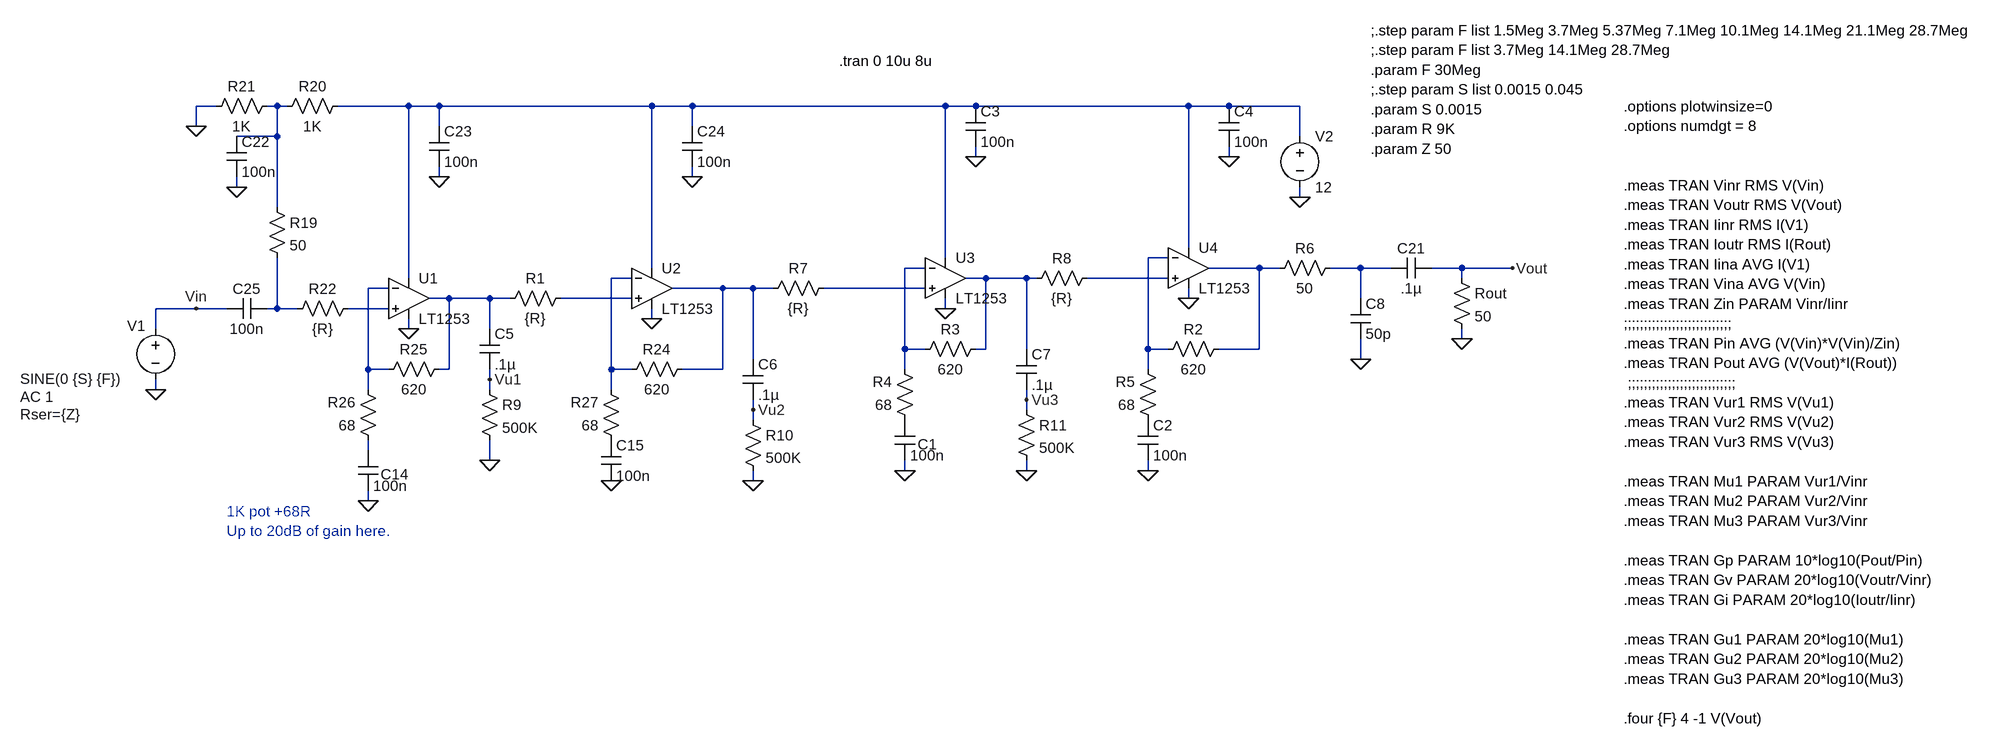
[diagram p0: schematic LT1253 Pre Amp Testing.asc]
LT1253 Pre Amp Testing.asc, the LTspice schematic file:
Version 4
SHEET 1 3748 1760
WIRE -3344 -288 -3376 -288
WIRE -3248 -288 -3264 -288
WIRE -3232 -288 -3248 -288
WIRE -3040 -288 -3152 -288
WIRE -2992 -288 -3040 -288
WIRE -2656 -288 -2992 -288
WIRE -2592 -288 -2656 -288
WIRE -2192 -288 -2592 -288
WIRE -2144 -288 -2192 -288
WIRE -1808 -288 -2144 -288
WIRE -1744 -288 -1808 -288
WIRE -1632 -288 -1744 -288
WIRE -3376 -256 -3376 -288
WIRE -2992 -256 -2992 -288
WIRE -2592 -256 -2592 -288
WIRE -3248 -240 -3248 -288
WIRE -3248 -240 -3312 -240
WIRE -1632 -240 -1632 -288
WIRE -2144 -208 -2144 -224
WIRE -1744 -208 -1744 -224
WIRE -2992 -176 -2992 -192
WIRE -2592 -176 -2592 -192
WIRE -3312 -160 -3312 -176
WIRE -1632 -144 -1632 -160
WIRE -3248 -128 -3248 -240
WIRE -1808 -64 -1808 -288
WIRE -2192 -48 -2192 -288
WIRE -1840 -48 -1872 -48
WIRE -2656 -32 -2656 -288
WIRE -2224 -32 -2256 -32
WIRE -1696 -32 -1776 -32
WIRE -1664 -32 -1696 -32
WIRE -1536 -32 -1584 -32
WIRE -1488 -32 -1536 -32
WIRE -1376 -32 -1424 -32
WIRE -1296 -32 -1376 -32
WIRE -3040 -16 -3040 -288
WIRE -2688 -16 -2720 -16
WIRE -2128 -16 -2160 -16
WIRE -2064 -16 -2128 -16
WIRE -2048 -16 -2064 -16
WIRE -1840 -16 -1968 -16
WIRE -1376 -16 -1376 -32
WIRE -3072 0 -3104 0
WIRE -2544 0 -2624 0
WIRE -2496 0 -2544 0
WIRE -2464 0 -2496 0
WIRE -2224 0 -2384 0
WIRE -2976 16 -3008 16
WIRE -2912 16 -2976 16
WIRE -2880 16 -2912 16
WIRE -2688 16 -2800 16
WIRE -1808 16 -1808 0
WIRE -1536 16 -1536 -32
WIRE -3376 32 -3440 32
WIRE -3328 32 -3376 32
WIRE -3248 32 -3248 -48
WIRE -3248 32 -3264 32
WIRE -3216 32 -3248 32
WIRE -3072 32 -3136 32
WIRE -2192 32 -2192 16
WIRE -2656 48 -2656 32
WIRE -3440 64 -3440 32
WIRE -3040 64 -3040 48
WIRE -2912 64 -2912 16
WIRE -1376 80 -1376 64
WIRE -2256 96 -2256 -32
WIRE -2224 96 -2256 96
WIRE -2128 96 -2128 -16
WIRE -2128 96 -2144 96
WIRE -2064 96 -2064 -16
WIRE -1872 96 -1872 -48
WIRE -1840 96 -1872 96
WIRE -1696 96 -1696 -32
WIRE -1696 96 -1760 96
WIRE -2496 112 -2496 0
WIRE -1536 112 -1536 80
WIRE -3104 128 -3104 0
WIRE -3072 128 -3104 128
WIRE -2976 128 -2976 16
WIRE -2976 128 -2992 128
WIRE -2720 128 -2720 -16
WIRE -2688 128 -2720 128
WIRE -2544 128 -2544 0
WIRE -2544 128 -2608 128
WIRE -2256 128 -2256 96
WIRE -1872 128 -1872 96
WIRE -2912 144 -2912 128
WIRE -3440 160 -3440 144
WIRE -3104 160 -3104 128
WIRE -2912 160 -2912 144
WIRE -2720 160 -2720 128
WIRE -2064 176 -2064 160
WIRE -2496 192 -2496 176
WIRE -2064 192 -2064 176
WIRE -2496 208 -2496 192
WIRE -3104 256 -3104 240
WIRE -2912 272 -2912 240
WIRE -2256 288 -2256 272
WIRE -2064 288 -2064 272
WIRE -1872 288 -1872 272
WIRE -2496 304 -2496 288
WIRE -3104 336 -3104 320
FLAG -3440 160 0
FLAG -3376 32 Vin
FLAG -2992 -176 0
FLAG -3312 -160 0
FLAG -3040 64 0
FLAG -2656 48 0
FLAG -2720 304 0
FLAG -2592 -176 0
FLAG -3376 -256 0
FLAG -3104 336 0
FLAG -2144 -208 0
FLAG -2192 32 0
FLAG -1808 16 0
FLAG -1872 288 0
FLAG -1744 -208 0
FLAG -2256 288 0
FLAG -1632 -144 0
FLAG -1376 80 0
FLAG -1296 -32 Vout
FLAG -2912 144 Vu1
FLAG -2912 272 0
FLAG -2496 192 Vu2
FLAG -2496 304 0
FLAG -2064 176 Vu3
FLAG -2064 288 0
FLAG -1536 112 0
SYMBOL voltage -3440 48 R0
WINDOW 0 -45 11 Left 2
WINDOW 3 -214 95 Left 2
WINDOW 123 -214 123 Left 2
WINDOW 39 -214 151 Left 2
SYMATTR InstName V1
SYMATTR Value SINE(0 {S} {F})
SYMATTR Value2 AC 1
SYMATTR SpiceLine Rser={Z}
SYMBOL voltage -1632 -256 R0
WINDOW 123 0 0 Left 0
WINDOW 39 0 0 Left 0
SYMATTR InstName V2
SYMATTR Value 12
SYMBOL Opamps\\LT1253 -3040 -48 R0
SYMATTR InstName U1
SYMBOL Opamps\\LT1253 -2656 -64 R0
SYMATTR InstName U2
SYMBOL res -3264 -144 R0
SYMATTR InstName R19
SYMATTR Value 50
SYMBOL res -3136 -304 R90
WINDOW 0 0 56 VBottom 2
WINDOW 3 32 56 VTop 2
SYMATTR InstName R20
SYMATTR Value 1K
SYMBOL res -3248 -304 R90
WINDOW 0 0 56 VBottom 2
WINDOW 3 32 56 VTop 2
SYMATTR InstName R21
SYMATTR Value 1K
SYMBOL res -3120 16 R90
WINDOW 0 0 56 VBottom 2
WINDOW 3 32 56 VTop 2
SYMATTR InstName R22
SYMATTR Value {R}
SYMBOL res -2592 112 R90
WINDOW 0 0 56 VBottom 2
WINDOW 3 32 56 VTop 2
SYMATTR InstName R24
SYMATTR Value 620
SYMBOL res -2976 112 R90
WINDOW 0 0 56 VBottom 2
WINDOW 3 32 56 VTop 2
SYMATTR InstName R25
SYMATTR Value 620
SYMBOL res -3088 256 R180
WINDOW 0 36 76 Left 2
WINDOW 3 36 40 Left 2
SYMATTR InstName R26
SYMATTR Value 68
SYMBOL res -2704 256 R180
WINDOW 0 36 76 Left 2
WINDOW 3 36 40 Left 2
SYMATTR InstName R27
SYMATTR Value 68
SYMBOL cap -3120 256 R0
WINDOW 0 36 38 Left 2
SYMATTR InstName C14
SYMATTR Value 100n
SYMBOL cap -2736 240 R0
SYMATTR InstName C15
SYMATTR Value 100n
SYMBOL cap -3328 -240 R0
SYMATTR InstName C22
SYMATTR Value 100n
SYMBOL cap -3008 -256 R0
SYMATTR InstName C23
SYMATTR Value 100n
SYMBOL cap -2608 -256 R0
SYMATTR InstName C24
SYMATTR Value 100n
SYMBOL cap -3264 16 R90
WINDOW 0 0 32 VBottom 2
WINDOW 3 32 32 VTop 2
SYMATTR InstName C25
SYMATTR Value 100n
SYMBOL Opamps\\LT1253 -2192 -80 R0
SYMATTR InstName U3
SYMBOL Opamps\\LT1253 -1808 -96 R0
SYMATTR InstName U4
SYMBOL res -1744 80 R90
WINDOW 0 0 56 VBottom 2
WINDOW 3 32 56 VTop 2
SYMATTR InstName R2
SYMATTR Value 620
SYMBOL res -2128 80 R90
WINDOW 0 0 56 VBottom 2
WINDOW 3 32 56 VTop 2
SYMATTR InstName R3
SYMATTR Value 620
SYMBOL res -2240 224 R180
WINDOW 0 36 76 Left 2
WINDOW 3 36 40 Left 2
SYMATTR InstName R4
SYMATTR Value 68
SYMBOL res -1856 224 R180
WINDOW 0 36 76 Left 2
WINDOW 3 36 40 Left 2
SYMATTR InstName R5
SYMATTR Value 68
SYMBOL cap -2272 208 R0
WINDOW 0 36 38 Left 2
SYMATTR InstName C1
SYMATTR Value 100n
SYMBOL cap -1888 208 R0
SYMATTR InstName C2
SYMATTR Value 100n
SYMBOL cap -2160 -288 R0
SYMATTR InstName C3
SYMATTR Value 100n
SYMBOL cap -1760 -288 R0
SYMATTR InstName C4
SYMATTR Value 100n
SYMBOL res -1568 -48 R90
WINDOW 0 0 56 VBottom 2
WINDOW 3 32 56 VTop 2
SYMATTR InstName R6
SYMATTR Value 50
SYMBOL res -2784 0 R90
WINDOW 0 0 56 VBottom 2
WINDOW 3 32 56 VTop 2
SYMATTR InstName R1
SYMATTR Value {R}
SYMBOL res -2368 -16 R90
WINDOW 0 0 56 VBottom 2
WINDOW 3 32 56 VTop 2
SYMATTR InstName R7
SYMATTR Value {R}
SYMBOL res -1952 -32 R90
WINDOW 0 0 56 VBottom 2
WINDOW 3 32 56 VTop 2
SYMATTR InstName R8
SYMATTR Value {R}
SYMBOL cap -1424 -48 R90
WINDOW 0 0 32 VBottom 2
WINDOW 3 32 32 VTop 2
SYMATTR InstName C21
SYMATTR Value .1µ
SYMBOL res -1392 -32 R0
SYMATTR InstName Rout
SYMATTR Value 50
SYMBOL cap -2928 64 R0
SYMATTR InstName C5
SYMATTR Value .1µ
SYMBOL res -2928 144 R0
SYMATTR InstName R9
SYMATTR Value 500K
SYMBOL cap -2512 112 R0
SYMATTR InstName C6
SYMATTR Value .1µ
SYMBOL res -2512 192 R0
SYMATTR InstName R10
SYMATTR Value 500K
SYMBOL cap -2080 96 R0
SYMATTR InstName C7
SYMATTR Value .1µ
SYMBOL res -2080 176 R0
SYMATTR InstName R11
SYMATTR Value 500K
SYMBOL cap -1552 16 R0
SYMATTR InstName C8
SYMATTR Value 50p
TEXT -3328 352 Left 2 ;1K pot +68R  \nUp to 20dB of gain here.
TEXT -2360 -360 Left 2 !.tran 0 10u 8u
TEXT -1120 -288 Left 2 !.options plotwinsize=0\n.options numdgt = 8\n \n \n.meas TRAN Vinr RMS V(Vin)\n.meas TRAN Voutr RMS V(Vout)\n.meas TRAN Iinr RMS I(V1)\n.meas TRAN Ioutr RMS I(Rout)\n.meas TRAN Iina AVG I(V1)\n.meas TRAN Vina AVG V(Vin)\n.meas TRAN Zin PARAM Vinr/Iinr\n;;;;;;;;;;;;;;;;;;;;;;;;;;;\n.meas TRAN Pin AVG (V(Vin)*V(Vin)/Zin)\n.meas TRAN Pout AVG (V(Vout)*I(Rout))\n ;;;;;;;;;;;;;;;;;;;;;;;;;;;\n.meas TRAN Vur1 RMS V(Vu1)\n.meas TRAN Vur2 RMS V(Vu2)\n.meas TRAN Vur3 RMS V(Vu3)\n \n.meas TRAN Mu1 PARAM Vur1/Vinr\n.meas TRAN Mu2 PARAM Vur2/Vinr\n.meas TRAN Mu3 PARAM Vur3/Vinr\n \n.meas TRAN Gp PARAM 10*log10(Pout/Pin)\n.meas TRAN Gv PARAM 20*log10(Voutr/Vinr)\n.meas TRAN Gi PARAM 20*log10(Ioutr/Iinr)\n \n.meas TRAN Gu1 PARAM 20*log10(Mu1)\n.meas TRAN Gu2 PARAM 20*log10(Mu2) \n.meas TRAN Gu3 PARAM 20*log10(Mu3)\n \n.four {F} 4 -1 V(Vout)
TEXT -1520 -408 Left 2 !;.step param F list 1.5Meg 3.7Meg 5.37Meg 7.1Meg 10.1Meg 14.1Meg 21.1Meg 28.7Meg\n;.step param F list 3.7Meg 14.1Meg 28.7Meg\n.param F 30Meg\n;.step param S list 0.0015 0.045\n.param S 0.0015\n.param R 9K\n.param Z 50

The netlist it stands for:
* LT1253 Pre Amp Testing.asc
V1 Vin 0 SINE(0 {S} {F}) AC 1 Rser={Z}
V2 N002 0 12
XU1 N016 N010 N002 0 N013 LT1253  ; pins In+ In- V+ V- OUT
XU2 N014 N007 N002 0 N011 LT1253  ; pins In+ In- V+ V- OUT
R19 N001 N015 50
R20 N002 N001 1K
R21 N001 0 1K
R22 N016 N015 {R}
R24 N011 N007 620
R25 N013 N010 620
R26 N017 N010 68
R27 P001 N007 68
C14 N017 0 100n
C15 P001 0 100n
C22 N001 0 100n
C23 N002 0 100n
C24 N002 0 100n
C25 N015 Vin 100n
XU3 N012 N004 N002 0 N008 LT1253  ; pins In+ In- V+ V- OUT
XU4 N009 N003 N002 0 N005 LT1253  ; pins In+ In- V+ V- OUT
R2 N005 N003 620
R3 N008 N004 620
R4 P002 N004 68
R5 P003 N003 68
C1 P002 0 100n
C2 P003 0 100n
C3 N002 0 100n
C4 N002 0 100n
R6 N006 N005 50
R1 N014 N013 {R}
R7 N012 N011 {R}
R8 N009 N008 {R}
C21 Vout N006 .1µ
Rout Vout 0 50
C5 N013 Vu1 .1µ
R9 Vu1 0 500K
C6 N011 Vu2 .1µ
R10 Vu2 0 500K
C7 N008 Vu3 .1µ
R11 Vu3 0 500K
C8 N006 0 50p
* 1K pot +68R
* Up to 20dB of gain here.
.tran 0 10u 8u
.options plotwinsize=0
.options numdgt = 8
.meas TRAN Vinr RMS V(Vin)
.meas TRAN Voutr RMS V(Vout)
.meas TRAN Iinr RMS I(V1)
.meas TRAN Ioutr RMS I(Rout)
.meas TRAN Iina AVG I(V1)
.meas TRAN Vina AVG V(Vin)
.meas TRAN Zin PARAM Vinr/Iinr
;;;;;;;;;;;;;;;;;;;;;;;;;;;
.meas TRAN Pin AVG (V(Vin)*V(Vin)/Zin)
.meas TRAN Pout AVG (V(Vout)*I(Rout))
 ;;;;;;;;;;;;;;;;;;;;;;;;;;;
.meas TRAN Vur1 RMS V(Vu1)
.meas TRAN Vur2 RMS V(Vu2)
.meas TRAN Vur3 RMS V(Vu3)
.meas TRAN Mu1 PARAM Vur1/Vinr
.meas TRAN Mu2 PARAM Vur2/Vinr
.meas TRAN Mu3 PARAM Vur3/Vinr
.meas TRAN Gp PARAM 10*log10(Pout/Pin)
.meas TRAN Gv PARAM 20*log10(Voutr/Vinr)
.meas TRAN Gi PARAM 20*log10(Ioutr/Iinr)
.meas TRAN Gu1 PARAM 20*log10(Mu1)
.meas TRAN Gu2 PARAM 20*log10(Mu2)
.meas TRAN Gu3 PARAM 20*log10(Mu3)
.four {F} 4 -1 V(Vout)
;.step param F list 1.5Meg 3.7Meg 5.37Meg 7.1Meg 10.1Meg 14.1Meg 21.1Meg 28.7Meg
;.step param F list 3.7Meg 14.1Meg 28.7Meg
.param F 30Meg
;.step param S list 0.0015 0.045
.param S 0.0015
.param R 9K
.param Z 50
.backanno
.end